# EAGLE schematic Schematic rangkaian krsri (EAGLE 9.6.1)
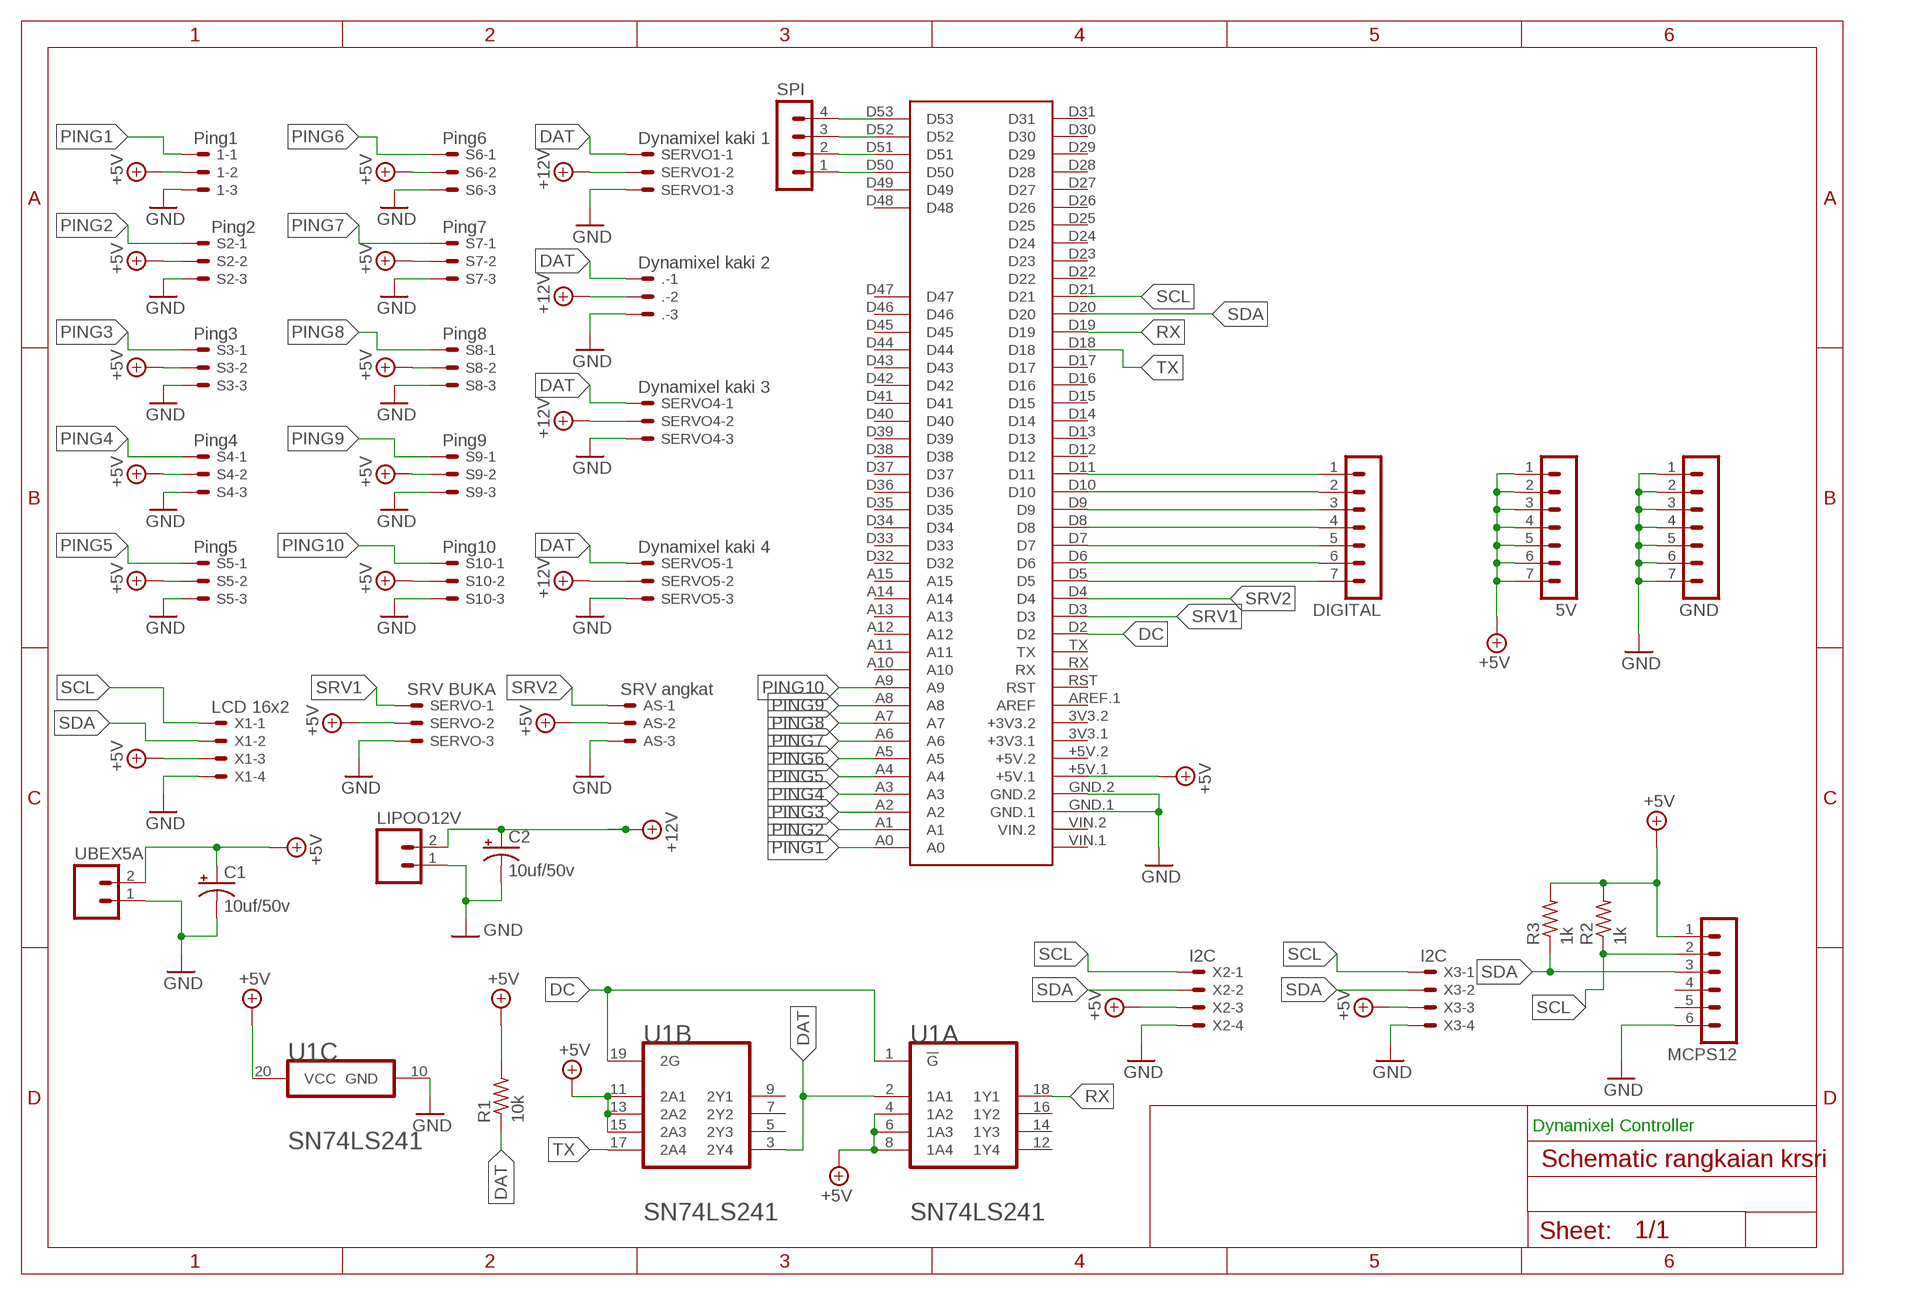
[diagram p0: schematic, sheet 1]

## Parts
1  Ping1  22-23-2031  [22-23-2031]
5V  MA07-1  [MA07-1]
.  Dynamixel kaki 2  22-23-2031  [22-23-2031]
AS  SRV angkat  22-23-2031  [22-23-2031]
C1  10uf/50v  CPOL-USE5-8.5  [E5-8,5]
C2  10uf/50v  CPOL-USE5-8.5  [E5-8,5]
DIGITAL  MA07-1  [MA07-1]
GND  MA07-1  [MA07-1]
LIPOO12V  M02  [02P]
MCPS12  MA06-1  [MA06-1]
R1  10k  R-US_0204/7  [0204/7]
R2  1k  R-US_0204/7  [0204/7]
R3  1k  R-US_0204/7  [0204/7]
S2  Ping2  22-23-2031  [22-23-2031]
S3  Ping3  22-23-2031  [22-23-2031]
S4  Ping4  22-23-2031  [22-23-2031]
S5  Ping5  22-23-2031  [22-23-2031]
S6  Ping6  22-23-2031  [22-23-2031]
S7  Ping7  22-23-2031  [22-23-2031]
S8  Ping8  22-23-2031  [22-23-2031]
S9  Ping9  22-23-2031  [22-23-2031]
S10  Ping10  22-23-2031  [22-23-2031]
SERVO  SRV BUKA  22-23-2031  [22-23-2031]
SERVO1  Dynamixel kaki 1  22-23-2031  [22-23-2031]
SERVO4  Dynamixel kaki 3  22-23-2031  [22-23-2031]
SERVO5  Dynamixel kaki 4  22-23-2031  [22-23-2031]
SPI  MA04-1  [MA04-1]
U1  TEXAS_INSTRUMENTS_SN74LS241TEXAS_INSTRUMENTS_SN74LS241_0_0  [TEXAS_INSTRUMENTS_SN74LS241_0]
U$1  MEGA2560_MIKRO  [MEGA2560_MIKRO]
UBEX5A  M02  [02P]
X1  LCD 16x2  22-23-2041  [22-23-2041]
X2  I2C  22-23-2041  [22-23-2041]
X3  I2C  22-23-2041  [22-23-2041]

## Nets
+5V: 1.2 5V.1 5V.2 5V.3 5V.4 5V.5 5V.6 5V.7 AS.2 C1.+ MCPS12.1 R1.2 R2.2 R3.2 S2.2 S3.2 S4.2 S5.2 S6.2 S7.2 S8.2 S9.2 S10.2 SERVO.2 U1.4(A:1A2) U1.6(A:1A3) U1.8(A:1A4) U1.11(B:2A1) U1.13(B:2A2) U1.15(B:2A3) U1.20(C:VCC) U$1.+5V.1 UBEX5A.2 X1.3 X2.3 X3.3
+12V: ..2 C2.+ LIPOO12V.2 SERVO1.2 SERVO4.2 SERVO5.2
DAT: ..1 R1.1 SERVO1.1 SERVO4.1 SERVO5.1 U1.2(A:1A1) U1.3(B:2Y4)
DC: U1.1(A:!G!) U1.19(B:2G) U$1.D2
GND: 1.3 ..3 AS.3 C1.- C2.- GND.1 GND.2 GND.3 GND.4 GND.5 GND.6 GND.7 LIPOO12V.1 MCPS12.6 S2.3 S3.3 S4.3 S5.3 S6.3 S7.3 S8.3 S9.3 S10.3 SERVO1.3 SERVO4.3 SERVO5.3 SERVO.3 U1.10(C:GND) U$1.GND.1 U$1.GND.2 UBEX5A.1 X1.4 X2.4 X3.4
N$1: SPI.4 U$1.D53
N$2: DIGITAL.7 U$1.D5
N$3: DIGITAL.6 U$1.D6
N$4: DIGITAL.5 U$1.D7
N$5: DIGITAL.4 U$1.D8
N$6: DIGITAL.3 U$1.D9
N$7: DIGITAL.2 U$1.D10
N$8: DIGITAL.1 U$1.D11
N$9: SPI.3 U$1.D52
N$10: SPI.2 U$1.D51
N$11: SPI.1 U$1.D50
PING1: 1.1 U$1.A0
PING2: S2.1 U$1.A1
PING3: S3.1 U$1.A2
PING4: S4.1 U$1.A3
PING5: S5.1 U$1.A4
PING6: S6.1 U$1.A5
PING7: S7.1 U$1.A6
PING8: S8.1 U$1.A7
PING9: S9.1 U$1.A8
PING10: S10.1 U$1.A9
RX: U1.18(A:1Y1) U$1.D19
SCL: MCPS12.2 R2.1 U$1.D21 X1.1 X2.1 X3.1
SDA: MCPS12.3 R3.1 U$1.D20 X1.2 X2.2 X3.2
SRV1: SERVO.1 U$1.D3
SRV2: AS.1 U$1.D4
TX: U1.17(B:2A4) U$1.D18
Unconnected: MCPS12.4 MCPS12.5 U1.5(B:2Y3) U1.7(B:2Y2) U1.9(B:2Y1) U1.12(A:1Y4) U1.14(A:1Y3) U1.16(A:1Y2) U$1.3V3.1(+3V3.1) U$1.3V3.2(+3V3.2) U$1.+5V.2 U$1.A10 U$1.A11 U$1.A12 U$1.A13 U$1.A14 U$1.A15 U$1.AREF.1(AREF) U$1.D12 U$1.D13 U$1.D14 U$1.D15 U$1.D16 U$1.D17 U$1.D22 U$1.D23 U$1.D24 U$1.D25 U$1.D26 U$1.D27 U$1.D28 U$1.D29 U$1.D30 U$1.D31 U$1.D32 U$1.D33 U$1.D34 U$1.D35 U$1.D36 U$1.D37 U$1.D38 U$1.D39 U$1.D40 U$1.D41 U$1.D42 U$1.D43 U$1.D44 U$1.D45 U$1.D46 U$1.D47 U$1.D48 U$1.D49 U$1.RST U$1.RX U$1.TX U$1.VIN.1 U$1.VIN.2

## Notes on the sheet
- Dynamixel Controller

## Library data of the parts
1 . AS S2-S10 SERVO SERVO1 SERVO4 SERVO5 = con-molex:22-23-2031: .100" (2.54mm) Center Header - 3 Pin; MF: MOLEX; MPN: 22-23-2031; OC_FARNELL: 1462950; OC_NEWARK: 30C0862
5V DIGITAL GND = con-lstb:MA07-1: PIN HEADER; OC_FARNELL: unknown; OC_NEWARK: unknown
C1 C2 = rcl:CPOL-US: POLARIZED CAPACITOR, American symbol; SPICEPREFIX: C
LIPOO12V UBEX5A = con-amp-quick:M02: AMP QUICK CONNECTOR; OC_FARNELL: unknown; OC_NEWARK: unknown
MCPS12 = con-lstb:MA06-1: PIN HEADER; OC_FARNELL: unknown; OC_NEWARK: unknown
R1-R3 = rcl:R-US_: RESISTOR, American symbol; SPICEPREFIX: R
SPI = con-lstb:MA04-1: PIN HEADER; OC_FARNELL: unknown; OC_NEWARK: unknown
U1 = SN74LS241:TEXAS_INSTRUMENTS_SN74LS241: TI-SN74LS_74S241-20; BITS: 8; CIIVA_IDS: 1348755; CODE__JEDEC: MS-001; DATASHEET_VERSION: SDLS144C; FOOTPRINT_VARIANT_NAME_0: Manufacturer Recommended; F__NOM_VOLTAGEMAXMHZ: 35; ICC__NOM_VOLTAGEMAXMA: 0.046; IMPORTED: yes; IMPORTED_FROM: vault; IMPORT_TS: 1521851976; INPUT_TYPE: TTL; MF: Texas Instruments; MPN: SN74LS241; OPERATING_TEMPERATURE_RANGEC: 0 to 70; OUTPUT_TYPE: TTL; PACKAGE: N0020A; PACKAGE_VERSION: http://www.ti.com/lit/ml/mpdi002c/mpdi002c.pdf; PREFIX: U; RATING: Catalog; RELEASE_DATE: 1459239443; TPD__NOM_VOLTAGEMAXNS: 18; VAULT_GUID: 3451E144-C486-4A48-AD08-3F2E02F82C0D; VAULT_REVISION: 66FE7A36-A9A5-40CE-8C73-C07E9184559F; VCC_MAX_V: 5.25; VCC_MIN_V: 4.75; VOLTAGE_NOM_V: 5
U$1 = MIKRO_MEGA2560:MEGA2560_MIKRO: Arduino Mega2560 pro robotDyn, create by mikroavr.com
X1-X3 = con-molex:22-23-2041: .100" (2.54mm) Center Header - 4 Pin; MF: MOLEX; MPN: 22-23-2041; OC_FARNELL: 1462920; OC_NEWARK: 38C0355